# Altium schematic sheet InputSockets.SchDoc
size A4; SheetNumber: 10; SheetTotal: 10
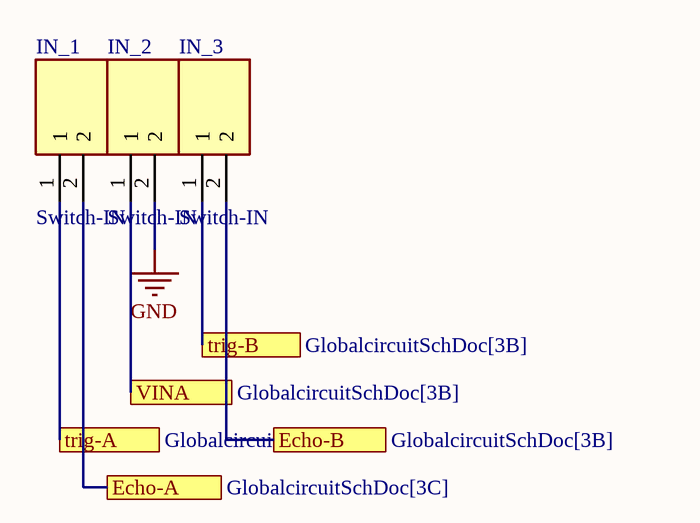
[diagram p0: InputSockets.SchDoc]

## Parts
IN_1  Switch-IN  [TE_796949-2]
IN_2  Switch-IN  [TE_796949-2]
IN_3  Switch-IN  [TE_796949-2]

## Ports
Echo-A (see GlobalcircuitSchDoc[3C]), Echo-B (see GlobalcircuitSchDoc[3B]), trig-A (see GlobalcircuitSchDoc[3B]), trig-B (see GlobalcircuitSchDoc[3B]), VINA (see GlobalcircuitSchDoc[3B])

## Nets
GND: IN_2.2
Echo-A: IN_1.2 ; port Echo-A
Echo-B: IN_3.2 ; port Echo-B
trig-A: IN_1.1 ; port trig-A
trig-B: IN_3.1 ; port trig-B
VINA: IN_2.1 ; port VINA

## Library data of the parts
IN_1-IN_3 = 796949-2: Connector Terminal Blocks 2 Position 5.08mm Solder Straight Thru-Hole 17.5A/Contact; MF: TE Connectivity; EU_RoHS_Compliance: Compliant with Exemptions; Price: None; Availability: Unavailable; TE_purchase_URL: https://www.te.com/usa-en/product-796949-2.html?te_bu=Cor&te_type=disp&te_campaign=seda_glo_cor-seda-global-disp-prtnr-fy19-seda-model-bom-cta_sma-317_1&elqCampaignId=32493; Package: None; SnapEDA_Link: https://www.snapeda.com/parts/796949-2/TE%20Connectivity%20AMP%20Connectors/view-part/492230/?ref=snap; MP: 796949-2; Value: *